# EAGLE design shackuino serial (EAGLE 5.09)
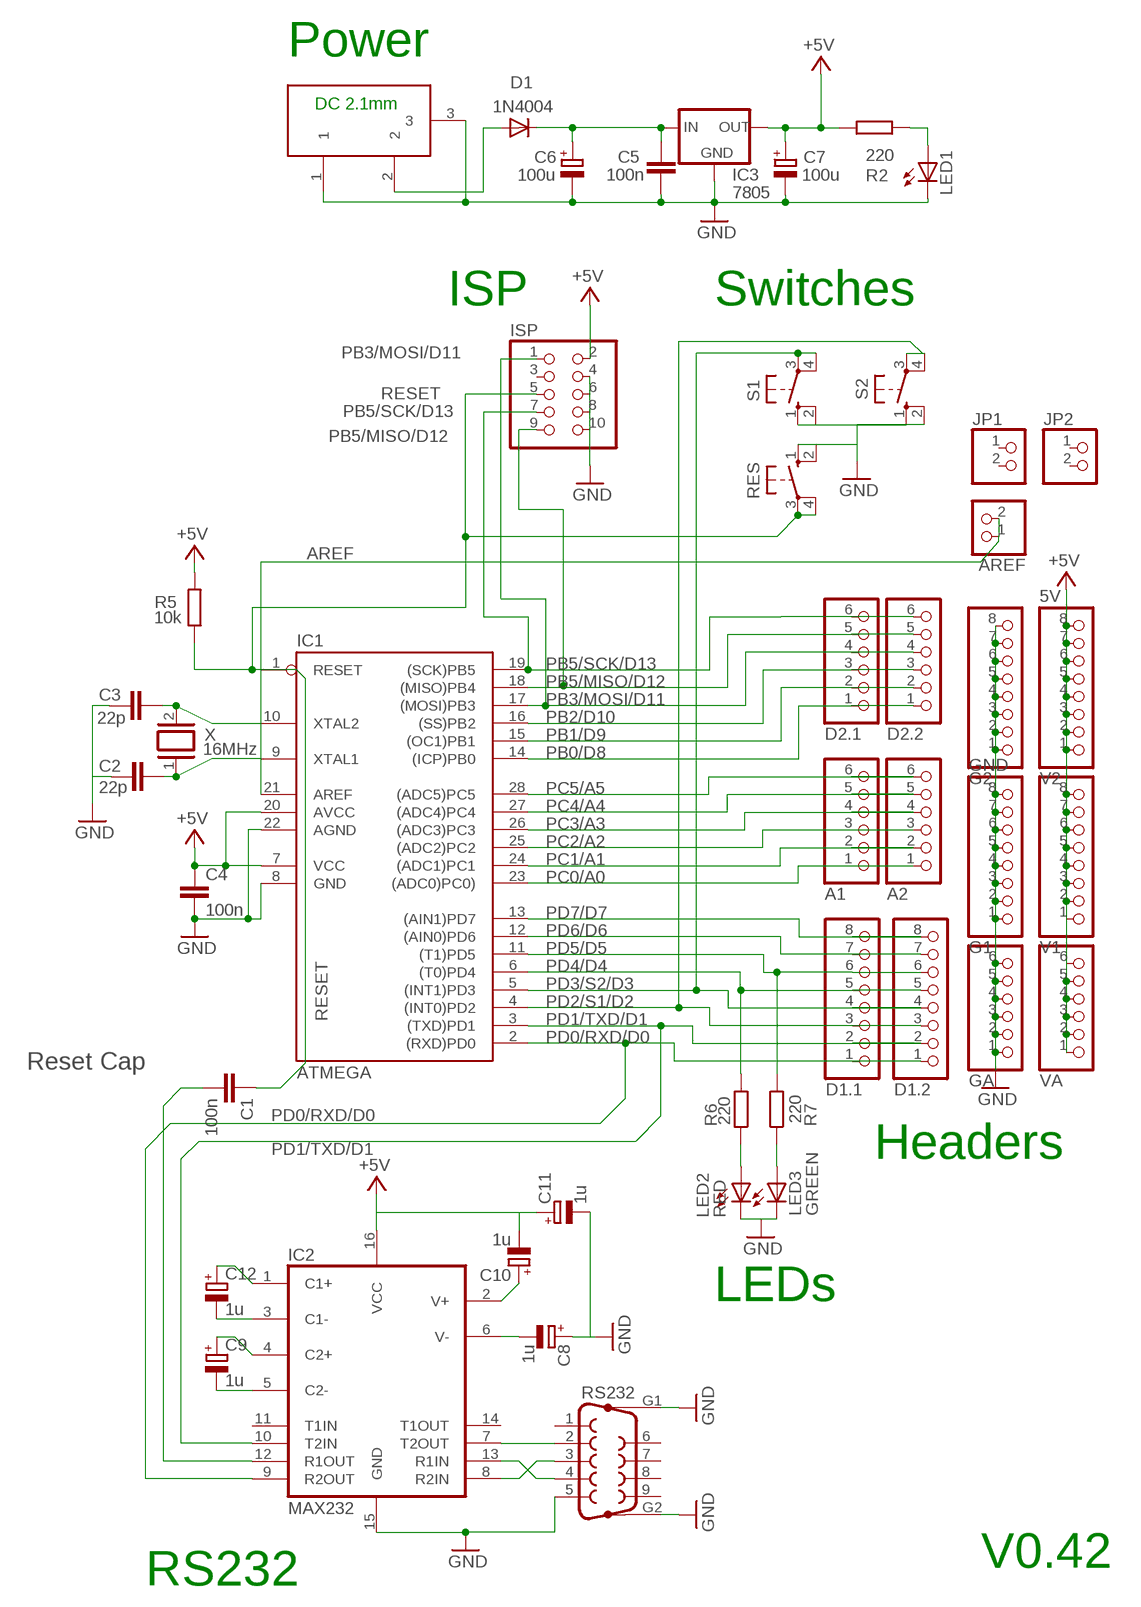
[diagram p0: schematic, sheet 1]

## Parts
A1  PINHD-1X6  [1X06]
A2  PINHD-1X6  [1X06]
AREF  PINHD-1X2NO_SILK  [1X02N]
C1  100n  C-EU025-024X044  [C025-024X044]
C2  22p  C-EU025-024X044  [C025-024X044]
C3  22p  C-EU025-024X044  [C025-024X044]
C4  100n  C-EU025-024X044  [C025-024X044]
C5  100n  C-EU025-024X044  [C025-024X044]
C6  100u  CPOL-EUE2.5-6  [E2,5-6]
C7  100u  CPOL-EUE2.5-6  [E2,5-6]
C8  1u  CPOL-EUE2.5-5  [E2,5-5]
C9  1u  CPOL-EUE2.5-5  [E2,5-5]
C10  1u  CPOL-EUE2.5-5  [E2,5-5]
C11  1u  CPOL-EUE2.5-5  [E2,5-5]
C12  1u  CPOL-EUE2.5-5  [E2,5-5]
D1  1N4004  1N4148DO35-7  [DO35-7]
D1.1  PINHD-1X8  [1X08]
D1.2  PINHD-1X8  [1X08]
D2.1  PINHD-1X6  [1X06]
D2.2  PINHD-1X6  [1X06]
DC  DC21MMX  [DC-21MM]
G1  GND  PINHD-1X8NO_SILK  [1X08N]
G2  PINHD-1X8NO_SILK  [1X08N]
GA  PINHD-1X6NO_SILK  [1X06N]
IC1  ATMEGA  AT90S4433P  [DIL28-3]
IC2  MAX232  MAX232PTH  [DIL16]
IC3  7805  78MXXS  [78MXXS]
ISP  PINHD-2X5  [2X05]
JP1  PINHD-1X2NO_SILK  [1X02N]
JP2  PINHD-1X2NO_SILK  [1X02N]
LED1  LED3MM  [LED3MM]
LED2  RED  LED3MM  [LED3MM]
LED3  GREEN  LED3MM  [LED3MM]
R2  220  R-EU_0204/2V  [0204V]
R5  10k  R-EU_0204/7  [0204/7]
R6  220  R-EU_0204/7  [0204/7]
R7  220  R-EU_0204/7  [0204/7]
RES  RESET  10-XX  [B3F-10XX]
RS232  F09HPNOSILK  [F09HP_NOSILK]
S1  D2  10-XX  [B3F-10XX]
S2  D2  10-XX  [B3F-10XX]
V1  PINHD-1X8NO_SILK  [1X08N]
V2  5V  PINHD-1X8NO_SILK  [1X08N]
VA  PINHD-1X6NO_SILK  [1X06N]
X  16MHz  XTAL/S  [QS]

## Nets
+5V [power]: C4.1 C7.+ C10.- C11.+ IC1.7(VCC) IC1.20(AVCC) IC2.16(VCC) IC3.OUT ISP.2 R2.2 R5.2 V1.1 V1.2 V1.3 V1.4 V1.5 V1.6 V1.7 V1.8 V2.1 V2.2 V2.3 V2.4 V2.5 V2.6 V2.7 V2.8 VA.1 VA.2 VA.3 VA.4 VA.5 VA.6
AREF: AREF.1 AREF.2 IC1.21(AREF)
GND [power]: C2.2 C3.2 C4.2 C5.1 C6.- C7.- C8.+ C11.- DC.1 DC.3 G1.1 G1.2 G1.3 G1.4 G1.5 G1.6 G1.7 G1.8 G2.1 G2.2 G2.3 G2.4 G2.5 G2.6 G2.7 G2.8 GA.1 GA.2 GA.3 GA.4 GA.5 GA.6 IC1.8(GND) IC1.22(AGND) IC2.15(GND) IC3.GND ISP.4 ISP.6 ISP.8 ISP.10 LED1.K(C) LED2.K(C) LED3.K(C) RES.1(S) RES.2(S1) RS232.5 RS232.G1 RS232.G2 S1.1(S) S1.2(S1) S2.1(S) S2.2(S1)
N$1: C9.+ IC2.4(C2+)
N$2: IC2.13(R1IN) RS232.4
N$3: LED1.A R2.1
N$4: C9.- IC2.5(C2-)
N$6: C12.- IC2.3(C1-)
N$7: C12.+ IC2.1(C1+)
N$8: D1.A DC.2
N$9: LED2.A R6.1
N$10: C10.+ IC2.2(V+)
N$11: C8.- IC2.6(V-)
N$13: IC2.7(T2OUT) RS232.2
N$14: IC2.8(R2IN) RS232.3
N$15: C1.2 IC2.12(R1OUT)
N$18: LED3.A R7.1
PB0/D8: D2.1.1 D2.2.1 IC1.14((ICP)PB0)
PB1/D9: D2.1.2 D2.2.2 IC1.15((OC1)PB1)
PB2/D10: D2.1.3 D2.2.3 IC1.16((SS)PB2)
PB3/MOSI/D11: D2.1.4 D2.2.4 IC1.17((MOSI)PB3) ISP.1
PB5/MISO/D12: D2.1.5 D2.2.5 IC1.18((MISO)PB4) ISP.9
PB5/SCK/D13: D2.1.6 D2.2.6 IC1.19((SCK)PB5) ISP.7
PC0/A0: A1.1 A2.1 IC1.23((ADC0)PC0))
PC1/A1: A1.2 A2.2 IC1.24((ADC1)PC1)
PC2/A2: A1.3 A2.3 IC1.25((ADC2)PC2)
PC3/A3: A1.4 A2.4 IC1.26((ADC3)PC3)
PC4/A4: A1.5 A2.5 IC1.27((ADC4)PC4)
PC5/A5: A1.6 A2.6 IC1.28((ADC5)PC5)
PD0/RXD/D0: D1.1.1 D1.2.1 IC1.2((RXD)PD0) IC2.9(R2OUT)
PD1/TXD/D1: D1.1.2 D1.2.2 IC1.3((TXD)PD1) IC2.10(T2IN)
PD2/S1/D2: D1.1.3 D1.2.3 IC1.4((INT0)PD2) S2.3(P) S2.4(P1)
PD3/S2/D3: D1.1.4 D1.2.4 IC1.5((INT1)PD3) S1.3(P) S1.4(P1)
PD4/D4: D1.1.5 D1.2.5 IC1.6((T0)PD4) R6.2
PD5/D5: D1.1.6 D1.2.6 IC1.11((T1)PD5) R7.2
PD6/D6: D1.1.7 D1.2.7 IC1.12((AIN0)PD6)
PD7/D7: D1.1.8 D1.2.8 IC1.13((AIN1)PD7)
RESET: C1.1 IC1.1(RESET) ISP.5 R5.1 RES.3(P) RES.4(P1)
VIN [power]: C5.2 C6.+ D1.C IC3.IN
X1: C3.1 IC1.10(XTAL2) X.2
X2: C2.1 IC1.9(XTAL1) X.1
Unconnected: IC2.11(T1IN) IC2.14(T1OUT) ISP.3 JP1.1 JP1.2 JP2.1 JP2.2 RS232.1 RS232.6 RS232.7 RS232.8 RS232.9

## Notes on the sheet
- Power
- DC 2.1mm
- ISP | Switches
- Reset Cap
- Headers
- LEDs
- V0.42
- RS232

## Library data of the parts
A1 A2 D2.1 D2.2 GA VA = pinhead:PINHD-1X6: PIN HEADER
AREF JP1 JP2 = pinhead:PINHD-1X2: PIN HEADER
C1-C5 = rcl:C-EU: CAPACITOR, European symbol
C6 C7 = rcl:CPOL-EU: POLARIZED CAPACITOR, European symbol
C8-C12 = resistor:CPOL-EU: POLARIZED CAPACITOR, European symbol
D1 = diode:1N4148: DIODE high speed (Philips)
D1.1 D1.2 G1 G2 V1 V2 = pinhead:PINHD-1X8: PIN HEADER
DC = powersupply:DC21MM
IC1 = atmel:AT90S4433: MICROCONTROLLER 4 Kbytes FLASH 128 bytes SRAM 256 bytes EEPROM UART 6-channel 10 bit ADC
IC2 = SparkFun:MAX232: RS232 Transceiver Very common IC. This is generically called 'MAX232', but works with the 3V equivalent MAX3232 generic ICs. Field tested and mother approved. Spark Fun Electronics SKU : COM-00316 (DIP) and COM-00589 (SMD)
IC3 = v-reg:78MXXS: VOLTAGE REGULATOR
ISP = pinhead:PINHD-2X5: PIN HEADER
LED1-LED3 = led:LED: LED OSRAM: - CHIPLED LG R971, LG N971, LY N971, LG Q971, LY Q971, LO R971, LY R971 LH N974, LH R974 LS Q976, LO Q976, LY Q976 LO Q996 - Hyper CHIPLED LW Q18S LB Q993, LB Q99A, LB R99A - SideLED LS A670, LO A670, LY A670, LG A670, LP A670 LB A673, LV A673, LT A673, LW A673 LH A674 LY A675 LS A676, LA A676, LO A676, LY A676, LW A676 LS A679, LY A679, LG A679 - Hyper Micro SIDELED® LS Y876, LA Y876, LO Y876, LY Y876 LT Y87S - SmartLED LW L88C, LW L88S LB L89C, LB L89S, LG L890 LS L89K, LO L89K, LY L89K LS L896, LA L896, LO L896, LY L896 - TOPLED LS T670, LO T670, LY T670, LG T670, LP T670 LSG T670, LSP T670, LSY T670, LOP T670, LYG T670 LG T671, LOG T671, LSG T671 LB T673, LV T673, LT T673, LW T673 LH T674 LS T676, LA T676, LO T676, LY T676, LB T676, LH T676, LSB T676, LW T676 LB T67C, LV T67C, LT T67C, LS T67K, LO T67K, LY T67K, LW E67C LS E67B, LA E67B, LO E67B, LY E67B, LB E67C, LV E67C, LT E67C LW T67C LS T679, LY T679, LG T679 LS T770, LO T770, LY T770, LG T770, LP T770 LB T773, LV T773, LT T773, LW T773 LH T774 LS E675, LA E675, LY E675, LS T675 LS T776, LA T776, LO T776, LY T776, LB T776 LHGB T686 LT T68C, LB T68C - Hyper Mini TOPLED® LB M676 - Mini TOPLED Santana® LG M470 LS M47K, LO M47K, LY M47K Source: http://www.osram.convergy.de LUXEON: - LUMILED® LXK2-PW12-R00, LXK2-PW12-S00, LXK2-PW14-U00, LXK2-PW14-V00 LXK2-PM12-R00, LXK2-PM12-S00, LXK2-PM14-U00 LXK2-PE12-Q00, LXK2-PE12-R00, LXK2-PE12-S00, LXK2-PE14-T00, LXK2-PE14-U00 LXK2-PB12-K00, LXK2-PB12-L00, LXK2-PB12-M00, LXK2-PB14-N00, LXK2-PB14-P00, LXK2-PB14-Q00 LXK2-PR12-L00, LXK2-PR12-M00, LXK2-PR14-Q00, LXK2-PR14-R00 LXK2-PD12-Q00, LXK2-PD12-R00, LXK2-PD12-S00 LXK2-PH12-R00, LXK2-PH12-S00 LXK2-PL12-P00, LXK2-PL12-Q00, LXK2-PL12-R00 Source: www.luxeon.com KINGBRIGHT: KA-3528ASYC Source: www.kingbright.com
R2 R5-R7 = rcl:R-EU_: RESISTOR, European symbol
RES S1 S2 = switch-omron:10-XX: OMRON SWITCH
RS232 = con-subd:F09HP: SUB-D
X = special:XTAL/S: CRYSTAL

## Net classes
1 power: width 0.61 mm

## Board
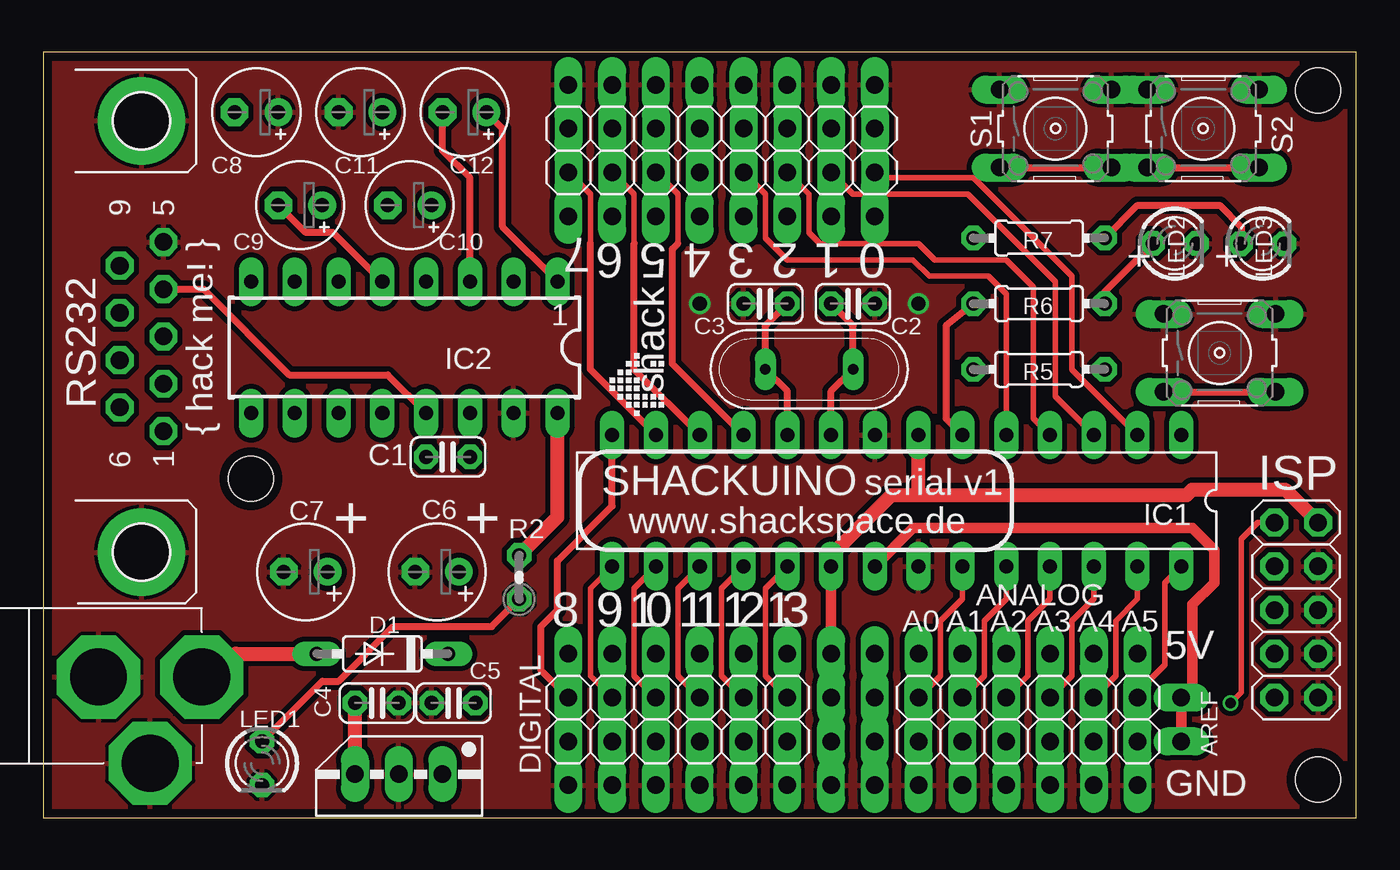
[diagram p1: board, top side]
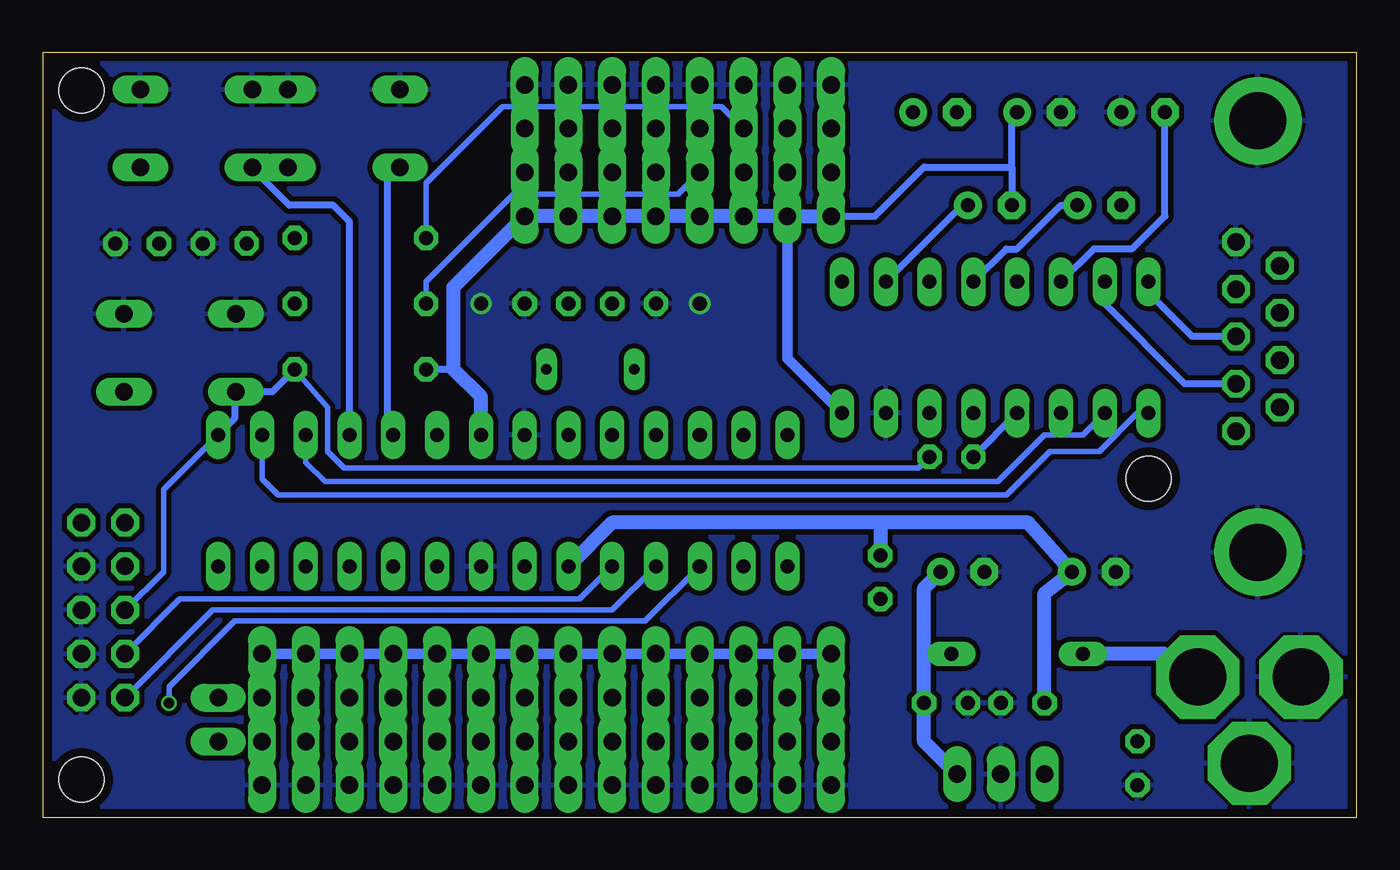
[diagram p2: board, bottom side, seen from below]

Size 76.2 x 44.45 mm. Coordinates in mm from the lower left corner, seen from the top.
Outline: 0,0 76.2,0 76.2,44.45 0,44.45 0,0
Copper layers (1*16): Top 0.035mm / dielectric 1.5mm / Bottom 0.035mm
Design rules "wedirekt": minimum track width 0.2mm, minimum drill 0.3mm, track to track 0.2mm, track to pad 0.2mm, pad to pad 0.2mm, via to via 0.2mm, smd to smd 0.2mm, copper to edge 20mil, drill to drill 10mil, minimum pad ring 0.3mm, minimum via ring 6mil, stop-mask expansion 0.1mm, vias tented up to drill 0mil, thermal gap 8mil
Holes 2.6 mm at 73.98,2.22 73.98,42.23 12.06,19.68

### Footprints (pad centres in the part's own frame; a part is rotated, then mirrored left to right if it is on the bottom)
1X06 = drill 1.016 long: 1 -6.35,0; 2 -3.81,0; 3 -1.27,0; 4 1.27,0; 5 3.81,0; 6 6.35,0
1X02N = drill 1.016 long: 1 -1.27,0; 2 1.27,0
C025-024X044 = drill 0.813 octagon: 1 -1.27,0; 2 1.27,0
E2,5-6 = drill 0.813 pad 1.6 round: + -1.27,0 | drill 0.813 pad 1.6 octagon: - 1.27,0
E2,5-5 = drill 0.813 pad 1.6 round: + -1.27,0 | drill 0.813 pad 1.6 octagon: - 1.27,0
DO35-7 = drill 0.813 long: A 3.81,0; C -3.81,0
1X08 = drill 1.016 long: 1 -8.89,0; 2 -6.35,0; 3 -3.81,0; 4 -1.27,0; 5 1.27,0; 6 3.81,0; 7 6.35,0; 8 8.89,0
DC-21MM = drill 3.302 pad 4.826 octagon: 1 -5.08,-3.353; 2 -0.076,-6.35; 3 -0.076,-0.356
1X08N = drill 1.016 long: 1 -8.89,0; 2 -6.35,0; 3 -3.81,0; 4 -1.27,0; 5 1.27,0; 6 3.81,0; 7 6.35,0; 8 8.89,0
1X06N = drill 1.016 long: 1 -6.35,0; 2 -3.81,0; 3 -1.27,0; 4 1.27,0; 5 3.81,0; 6 6.35,0
DIL28-3 = drill 0.813 long: 1 -16.51,-3.81; 2 -13.97,-3.81; 3 -11.43,-3.81; 4 -8.89,-3.81; 5 -6.35,-3.81; 6 -3.81,-3.81; 7 -1.27,-3.81; 8 1.27,-3.81; 9 3.81,-3.81; 10 6.35,-3.81; 11 8.89,-3.81; 12 11.43,-3.81; 13 13.97,-3.81; 14 16.51,-3.81; 15 16.51,3.81; 16 13.97,3.81; 17 11.43,3.81; 18 8.89,3.81; 19 6.35,3.81; 20 3.81,3.81; 21 1.27,3.81; 22 -1.27,3.81; 23 -3.81,3.81; 24 -6.35,3.81; 25 -8.89,3.81; 26 -11.43,3.81; 27 -13.97,3.81; 28 -16.51,3.81
DIL16 = drill 0.813 long: 1 -8.89,-3.81; 2 -6.35,-3.81; 3 -3.81,-3.81; 4 -1.27,-3.81; 5 1.27,-3.81; 6 3.81,-3.81; 7 6.35,-3.81; 8 8.89,-3.81; 9 8.89,3.81; 10 6.35,3.81; 11 3.81,3.81; 12 1.27,3.81; 13 -1.27,3.81; 14 -3.81,3.81; 15 -6.35,3.81; 16 -8.89,3.81
78MXXS = drill 1.016 long: GND 0,-2.54; IN -2.54,-2.54; OUT 2.54,-2.54
2X05 = drill 1.016 octagon: 1 -5.08,-1.27; 2 -5.08,1.27; 3 -2.54,-1.27; 4 -2.54,1.27; 5 0,-1.27; 6 0,1.27; 7 2.54,-1.27; 8 2.54,1.27; 9 5.08,-1.27; 10 5.08,1.27
LED3MM = drill 0.813 octagon: A -1.27,0; K 1.27,0
0204V = drill 0.813 octagon: 1 -1.27,0; 2 1.27,0
0204/7 = drill 0.813 octagon: 1 -3.81,0; 2 3.81,0
B3F-10XX = drill 1.016 long: 1 -3.251,2.261; 2 3.251,2.261; 3 -3.251,-2.261; 4 3.251,-2.261
F09HP_NOSILK = drill 1.016 octagon: 1 -5.486,-1.27; 2 -2.743,-1.27; 3 0,-1.27; 4 2.743,-1.27; 5 5.486,-1.27; 6 -4.115,1.27; 7 -1.372,1.27; 8 1.372,1.27; 9 4.115,1.27 | drill 3.302 pad 5.08 round: G1 -12.522,0; G2 12.522,0
QS = drill 0.61 long: 1 -2.54,0; 2 2.54,0

### Placement (x,y rotation side)
A1  57.15,4.45 0 top
A2  57.15,6.99 0 top
AREF  66.04,5.71 90 top
C1  23.5,20.95 180 top
C2  46.99,29.84 0 top
C3  41.91,29.84 180 top
C4  19.37,6.67 0 top
C5  23.81,6.67 0 top
C6  22.86,14.29 180 top
C7  15.24,14.29 180 top
C8  12.38,40.96 180 top
C9  14.92,35.56 180 top
C10  21.27,35.56 180 top
C11  18.41,40.96 180 top
C12  24.45,40.96 180 top
D1  19.68,9.53 180 top
D1.1  39.37,40.01 180 top
D1.2  39.37,37.47 180 top
D2.1  36.83,6.99 0 top
D2.2  36.83,4.45 0 top
DC  2.86,8.26 90 top
G1  39.37,42.55 0 top
G2  39.37,1.91 0 top
GA  57.15,1.91 180 top
IC1  49.53,18.41 180 top
IC2  20.95,27.3 180 top
IC3  20.64,0 180 top
ISP  72.71,12.06 270 top
JP1  46.99,4.45 0 top
JP2  46.99,6.99 0 top
LED1  12.7,3.17 270 top
LED2  65.66,33.34 0 top
LED3  70.74,33.32 0 top
R2  27.62,13.97 90 top
R5  57.78,26.04 180 top
R6  57.78,29.84 180 top
R7  57.78,33.66 180 top
RES  68.26,26.99 0 top
RS232  5.71,27.94 90 top
S1  58.74,40.01 0 top
S2  67.31,40.01 0 top
V1  39.37,9.53 0 top
V2  39.37,34.92 0 top
VA  57.15,9.53 180 top
X  44.45,26.04 180 top

### Tracks (layer width: path | path; a pad name or v marks a point on that pad's centre or on a via)
+5V
  Top 0.61: IC1.20 V1.7
  Top 0.813: IC3.OUT C4.1 | IC1.20 45.72,15.24 49.21,18.73 50.8,18.73 | 50.8,18.73 66.36,18.73 66.67,19.05 72.07,19.05 ISP.2 | 50.8,18.73 IC1.7 | IC2.16 29.84,17.46 R2.2
  Bottom 0.406: 52.39,26.04 R5.2 | C11.+ 20,40.64 20,37.78 | 20,37.78 C10.- | V2.1 27.94,34.92 25.08,37.78 20,37.78
  Bottom 0.61: V1.1 V1.2 V1.3 V1.4 V1.5 V1.6 V1.7 V1.8 VA.6 VA.5 VA.4 VA.3 VA.2 VA.1 | IC2.16 33.02,26.67 V2.2
  Bottom 0.813: V2.1 V2.2 V2.3 V2.4 V2.5 V2.6 V2.7 V2.8 52.39,30.8 52.39,26.04 50.8,24.45 IC1.7 | IC1.20 43.18,17.14 27.62,17.14 | C4.1 18.1,13.02 C7.+ 19.05,17.14 27.62,17.14 | 27.62,17.14 R2.2
AREF
  Top 0.61: IC1.21 50.48,16.83 66.67,16.83 67.94,15.56 67.94,13.65 66.67,12.38 66.67,7.62 AREF.2 AREF.1
GND  (via drill 0.81 pad 1.22)
  other vias: 38.1,29.84 50.8,29.84
  pour Top (isolate 0.3): -1.91,45.72 77.47,45.72 77.47,-1.27 -1.91,-1.27
  pour Bottom (isolate 0.3, rank 2): -1.91,45.72 77.47,45.72 77.47,-1.27 -1.91,-1.27
N$1
  Bottom 0.406: C9.+ 17.14,35.56 19.68,33.02 20.32,33.02 IC2.4
N$2
  Top 0.406: RS232.4 9.32,30.68 14.29,25.72 20,25.72 IC2.13
N$3
  Top 0.406: LED1.A 16.19,7.94 17.14,7.94 20.32,11.11 26.04,11.11 R2.1
N$4
  Top 0.406: C9.- 15.24,33.97 16.83,33.97 IC2.5
N$6
  Top 0.406: C12.- 23.18,38.73 24.77,37.15 IC2.3
N$7
  Top 0.406: C12.+ 26.67,40.01 26.67,34.29 IC2.1
N$8
  Top 0.813: DC.2 11.19,9.53 D1.A
  Bottom 0.813: DC.2 11.19,9.53 D1.A
N$9
  Top 0.406: R6.1 61.59,30.54 LED2.A
N$10
  Bottom 0.406: C10.+ 22.86,35.56 IC2.2
N$11
  Bottom 0.406: IC2.6 15.24,33.02 13.02,33.02 11.11,34.92 C8.-
N$13
  Bottom 0.406: RS232.2 9.96,25.2 14.61,29.84 IC2.7
N$14
  Bottom 0.406: RS232.3 9.53,27.94 12.06,30.48 IC2.8
N$15
  Bottom 0.406: C1.2 IC2.12
N$18
  Top 0.406: R7.1 63.5,35.56 68.26,35.56 69.53,34.29 LED3.A
PB0/D8
  Top 0.406: IC1.14 33.02,18.1 29.84,14.92 29.84,12.06 28.89,11.11 28.89,8.57 D2.1.1
  Top 0.61: D2.2.1 D2.1.1
  Bottom 0.61: D2.2.1 D2.1.1
PB1/D9
  Top 0.305: IC1.15 31.75,13.34 31.75,8.26 D2.1.2
  Top 0.61: D2.2.2 D2.1.2
  Bottom 0.61: D2.2.2 D2.1.2
PB2/D10
  Top 0.305: IC1.16 34.29,13.34 34.29,8.26 D2.1.3
  Top 0.61: D2.2.3 D2.1.3
  Bottom 0.61: D2.2.3 D2.1.3
PB3/MOSI/D11  (via drill 0.6)
  Top 0.305: IC1.17 36.83,13.34 36.83,8.26 D2.1.4 | ISP.1 70.48,17.14 69.53,16.19 69.53,7.3 v68.9,6.67
  Top 0.61: D2.2.4 D2.1.4
  Bottom 0.305: IC1.17 41.27,11.43 65.09,11.43 68.9,7.62 v68.9,6.67
  Bottom 0.61: D2.2.4 D2.1.4
PB5/MISO/D12
  Top 0.305: IC1.18 39.37,13.34 39.37,8.26 D2.1.5
  Top 0.61: D2.2.5 D2.1.5
  Bottom 0.305: IC1.18 43.18,12.06 66.36,12.06 ISP.9
  Bottom 0.61: D2.2.5 D2.1.5
PB5/SCK/D13
  Top 0.305: IC1.19 41.91,13.34 41.91,8.26 D2.1.6
  Top 0.61: D2.2.6 D2.1.6
  Bottom 0.305: IC1.19 45.09,12.7 68.26,12.7 ISP.7
  Bottom 0.61: D2.2.6 D2.1.6
PC0/A0
  Top 0.305: IC1.23 53.34,12.7 52.07,11.43 52.07,8.26 A2.1
  Top 0.61: A1.1 A2.1
  Bottom 0.61: A1.1 A2.1
PC1/A1
  Top 0.305: IC1.24 55.88,12.7 54.61,11.43 54.61,8.26 A2.2
  Top 0.61: A1.2 A2.2
  Bottom 0.61: A1.2 A2.2
PC2/A2
  Top 0.305: IC1.25 58.42,12.7 57.15,11.43 57.15,8.26 A2.3
  Top 0.61: A1.3 A2.3
  Bottom 0.61: A1.3 A2.3
PC3/A3
  Top 0.305: IC1.26 60.96,12.7 59.69,11.43 59.69,8.26 A2.4
  Top 0.61: A1.4 A2.4
  Bottom 0.61: A1.4 A2.4
PC4/A4
  Top 0.305: IC1.27 63.5,12.7 62.23,11.43 62.23,8.26 A2.5
  Top 0.61: A1.5 A2.5
  Bottom 0.61: A1.5 A2.5
PC5/A5
  Top 0.305: IC1.28 65.09,13.65 65.09,8.89 63.5,7.3 A2.6
  Top 0.61: A1.6 A2.6
  Bottom 0.61: A1.6 A2.6
PD0/RXD/D0
  Top 0.305: D1.2.1 48.9,37.15 53.98,37.15 59.69,31.43 59.69,26.04 IC1.2
  Top 0.61: D1.2.1 D1.1.1
  Bottom 0.305: IC1.2 63.5,19.68 62.55,18.73 20.32,18.73 17.78,21.27 14.92,21.27 12.7,23.5 IC2.9
  Bottom 0.61: D1.2.1 D1.1.1
PD1/TXD/D1
  Top 0.305: D1.2.2 46.99,36.2 53.66,36.2 58.74,31.11 58.74,24.45 IC1.3
  Top 0.61: D1.2.2 D1.1.2
  Bottom 0.305: IC1.3 60.96,20.64 59.85,19.53 20.8,19.53 18.1,22.23 15.88,22.23 IC2.10
  Bottom 0.61: D1.2.2 D1.1.2
PD2/S1/D2
  Top 0.305: D1.2.3 44.45,36.2 44.45,33.97 45.09,33.34 50.8,33.34 51.75,32.38 55.88,32.38 57.47,30.8 57.47,23.18 IC1.4
  Top 0.406: S2.3 S2.4
  Top 0.61: D1.2.3 D1.1.3
  Bottom 0.406: S2.3 64.06,37.71 61.91,35.56 59.37,35.56 58.42,34.61 IC1.4
  Bottom 0.61: D1.2.3 D1.1.3
PD3/S2/D3
  Top 0.305: D1.2.4 41.91,36.2 41.91,33.66 43.18,32.38 50.48,32.38 51.44,31.43 54.86,31.43 55.88,30.41 IC1.5
  Top 0.406: S1.3 S1.4
  Top 0.61: D1.2.4 D1.1.4
  Bottom 0.406: IC1.5 56.2,22.54 56.2,37.03 S1.3
  Bottom 0.61: D1.2.4 D1.1.4
PD4/D4
  Top 0.406: IC1.6 52.39,23.18 52.39,28.57 R6.2
  Top 0.61: D1.2.5 D1.1.5
  Bottom 0.305: R6.2 53.98,31.11 48.9,36.2 39.37,36.2 D1.2.5
  Bottom 0.61: D1.2.5 D1.1.5
PD5/D5
  Top 0.305: 36.83,33.34 36.83,36.2 D1.2.6
  Top 0.406: 36.83,33.34 36.51,33.02 36.51,26.35 IC1.11
  Top 0.61: D1.2.6 D1.1.6
  Bottom 0.305: R7.2 53.98,36.83 49.53,41.27 36.83,41.27 D1.1.6
  Bottom 0.61: D1.2.6 D1.1.6
PD6/D6
  Top 0.305: 34.29,33.34 34.29,36.2 D1.2.7
  Top 0.406: IC1.12 34.29,26.04 34.29,33.34
  Top 0.61: D1.2.7 D1.1.7
  Bottom 0.61: D1.2.7 D1.1.7
PD7/D7
  Top 0.305: 31.75,33.34 31.75,36.2 D1.2.8
  Top 0.406: IC1.13 31.75,26.04 31.75,33.34
  Top 0.61: D1.2.8 D1.1.8
  Bottom 0.61: D1.2.8 D1.1.8
RESET
  Top 0.406: RES.3 RES.4
  Bottom 0.305: ISP.5 69.22,14.29 69.22,19.05 IC1.1 | R5.1 59.69,23.81 59.69,21.27 58.74,20.32 25.4,20.32 C1.1
  Bottom 0.406: IC1.1 66.04,22.26 66,22.26 65.09,23.18 65.09,24.73 RES.3 62.9,24.73 R5.1
VIN
  Bottom 0.813: IC3.IN 25.08,4.45 C5.2 25.08,9.53 | 25.08,9.53 25.08,13.34 C6.+ | 25.08,9.53 D1.C
X1
  Top 0.406: IC1.10 43.18,24.77 X.2 41.91,28.57 C3.1
X2
  Top 0.406: IC1.9 45.72,24.77 X.1 46.99,28.57 C2.1

### Text on the board
tPlace: 7 | 6 | 5 | 4 | 3 | 2 | 1 | 0 | + | + | 1 | hack | s | { hack me! } | SHACKUINO | serial v1 | www.shackspace.de | + | + | ANALOG | 8 | 9 | 1 | 0 | 1 | 1 | 1 | 2 | 1 | 3 | A0 | A1 | A2 | A3 | A4 | A5 | 5V | DIGITAL | GND
tDocu: DIGITAL | 1 | 1